# Altium schematic sheet ULN2003_Drv.SchDoc
size A4
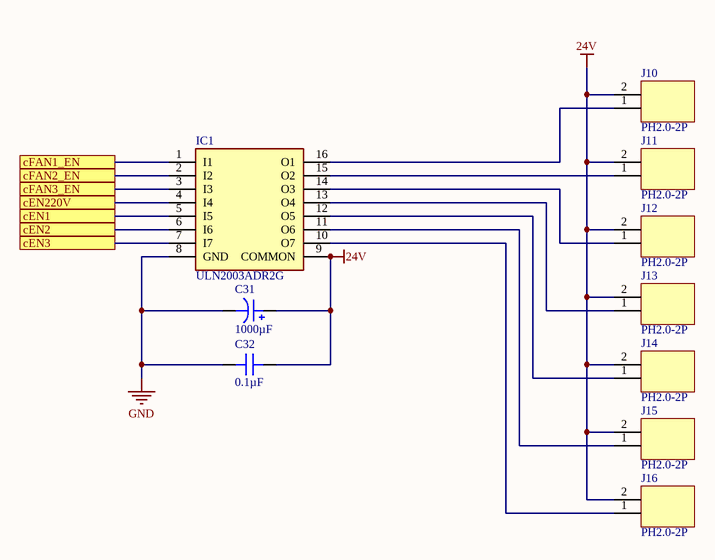
[diagram p0: ULN2003_Drv.SchDoc]

## Parts
C31  1000µF  [CAP TH ALUM ELEC D22.00mm S10.00mm H27.00mm]
C32  0.1µF  [CAP 0805_2012]
IC1  ULN2003ADR2G  [SOIC127P600X175-16N]
J10  PH2.0-2P  [PH2.0-2P]
J11  PH2.0-2P  [PH2.0-2P]
J12  PH2.0-2P  [PH2.0-2P]
J13  PH2.0-2P  [PH2.0-2P]
J14  PH2.0-2P  [PH2.0-2P]
J15  PH2.0-2P  [PH2.0-2P]
J16  PH2.0-2P  [PH2.0-2P]

## Ports
cEN1, cEN2, cEN3, cEN220V, cFAN1_EN, cFAN2_EN, cFAN3_EN

## Nets
24V: C31.1 C32.1 IC1.9(COMMON) J10.2 J11.2 J12.2 J13.2 J14.2 J15.2 J16.2
GND: C31.2 C32.2 IC1.8(GND)
cEN1: IC1.5(I5) ; port cEN1
cEN2: IC1.6(I6) ; port cEN2
cEN3: IC1.7(I7) ; port cEN3
cEN220V: IC1.4(I4) ; port cEN220V
cFAN1_EN: IC1.1(I1) ; port cFAN1_EN
cFAN2_EN: IC1.2(I2) ; port cFAN2_EN
cFAN3_EN: IC1.3(I3) ; port cFAN3_EN
NetIC1_10: IC1.10(O7) J16.1
NetIC1_11: IC1.11(O6) J15.1
NetIC1_12: IC1.12(O5) J14.1
NetIC1_13: IC1.13(O4) J13.1
NetIC1_14: IC1.14(O3) J12.1
NetIC1_15: IC1.15(O2) J11.1
NetIC1_16: IC1.16(O1) J10.1

## Library data of the parts
C31 = LKG1V102MESZCK: CAP ALUM 1000UF 20% 35V SNAP IN; Manufacturer: Nichicon; Lifetime @ Temp.: 1000 Hrs @ 85°C; Polarization: Polar; Ripple Current @ Low Frequency: 1A @ 120Hz; Part Number: LKG1V102MESZCK; Applications: Audio; Capacitance: 1000µF; ComponentLink1Description: Datasheet; ComponentLink1URL: http://nichicon-us.com/english/products/pdfs/e-lkg.pdf; ComponentLink2Description: DigiKey Link; ComponentLink2URL: http://digikey.com/product-detail/en/nichicon/LKG1V102MESZCK/493-17542-ND/7698947; Device Package: Radial, Can - Snap-In; Height - Seated (Max): 1.063" (27.00mm); LastUpdated: 02.09.2020 01:30:15; Lead Spacing: 0.394" (10.00mm); Lifecycle Status: Active; Minimum Order: 1; Mounting Type: Through Hole; Operating Temperature: -40°C ~ 85°C; Package / Case: Radial, Can - Snap-In; Packaging: Bulk; PartId: 10430; Part Status: Active; Price: 4.27; Series: LKG; Size / Dimension: 0.866" Dia (22.00mm); Supplier 1: DigiKey; Supplier Part Number 1: 493-17542-ND; Tolerance: ±20%; Value: 1000µF; Voltage - Rated: 35V
C32 = CC0805MRX7R9BB104: CAP CER 0.1UF 50V X7R 0805; Manufacturer: Yageo; Tolerance: ±20%; Part Number: CC0805MRX7R9BB104; Value: 0.1µF; Applications: General Purpose; Capacitance: 0.1µF; ComponentLink1Description: Datasheet; ComponentLink1URL: https://www.yageo.com/upload/media/product/productsearch/datasheet/mlcc/UPY-GPHC_X7R_6.3V-to-50V_18.pdf; ComponentLink2Description: DigiKey Link; ComponentLink2URL: http://digikey.com/product-detail/en/yageo/CC0805MRX7R9BB104/311-4351-1-ND/8025440; Device Package: 0805 (2012 Metric); LastUpdated: 02.09.2020 01:04:42; Lifecycle Status: Active; Minimum Order: 1; Mounting Type: Surface Mount, MLCC; Operating Temperature: -55°C ~ 125°C; Package / Case: 0805 (2012 Metric); Packaging: TapeAndReel; PartId: 2475; Part Status: Active; Price: 0.02; Series: CC; Size / Dimension: 0.079" L x 0.049" W (2.00mm x 1.25mm); Supplier 1: DigiKey; Supplier Part Number 1: 311-4351-1-ND; Temperature Coefficient: X7R; Thickness (Max): 0.037" (0.95mm); Voltage - Rated: 50V
IC1 = ULN2003ADR2G: Integrated Circuit; Manufacturer_Name: ON Semiconductor; Datasheet Link: http://www.onsemi.com/pub/Collateral/ULN2003A-D.PDF; Height: 1.75mm; Manufacturer_Part_Number: ULN2003ADR2G; Mouser Part Number: 863-ULN2003ADR2G; Mouser Price/Stock: https://www.mouser.co.uk/ProductDetail/onsemi/ULN2003ADR2G?qs=t2BMfLoP1KRgd83C6tnDAg%3D%3D; Arrow Part Number: ULN2003ADR2G; Arrow Price/Stock: https://www.arrow.com/en/products/uln2003adr2g/on-semiconductor?region=nac